# EAGLE design BEP30 (EAGLE 6.5.0)
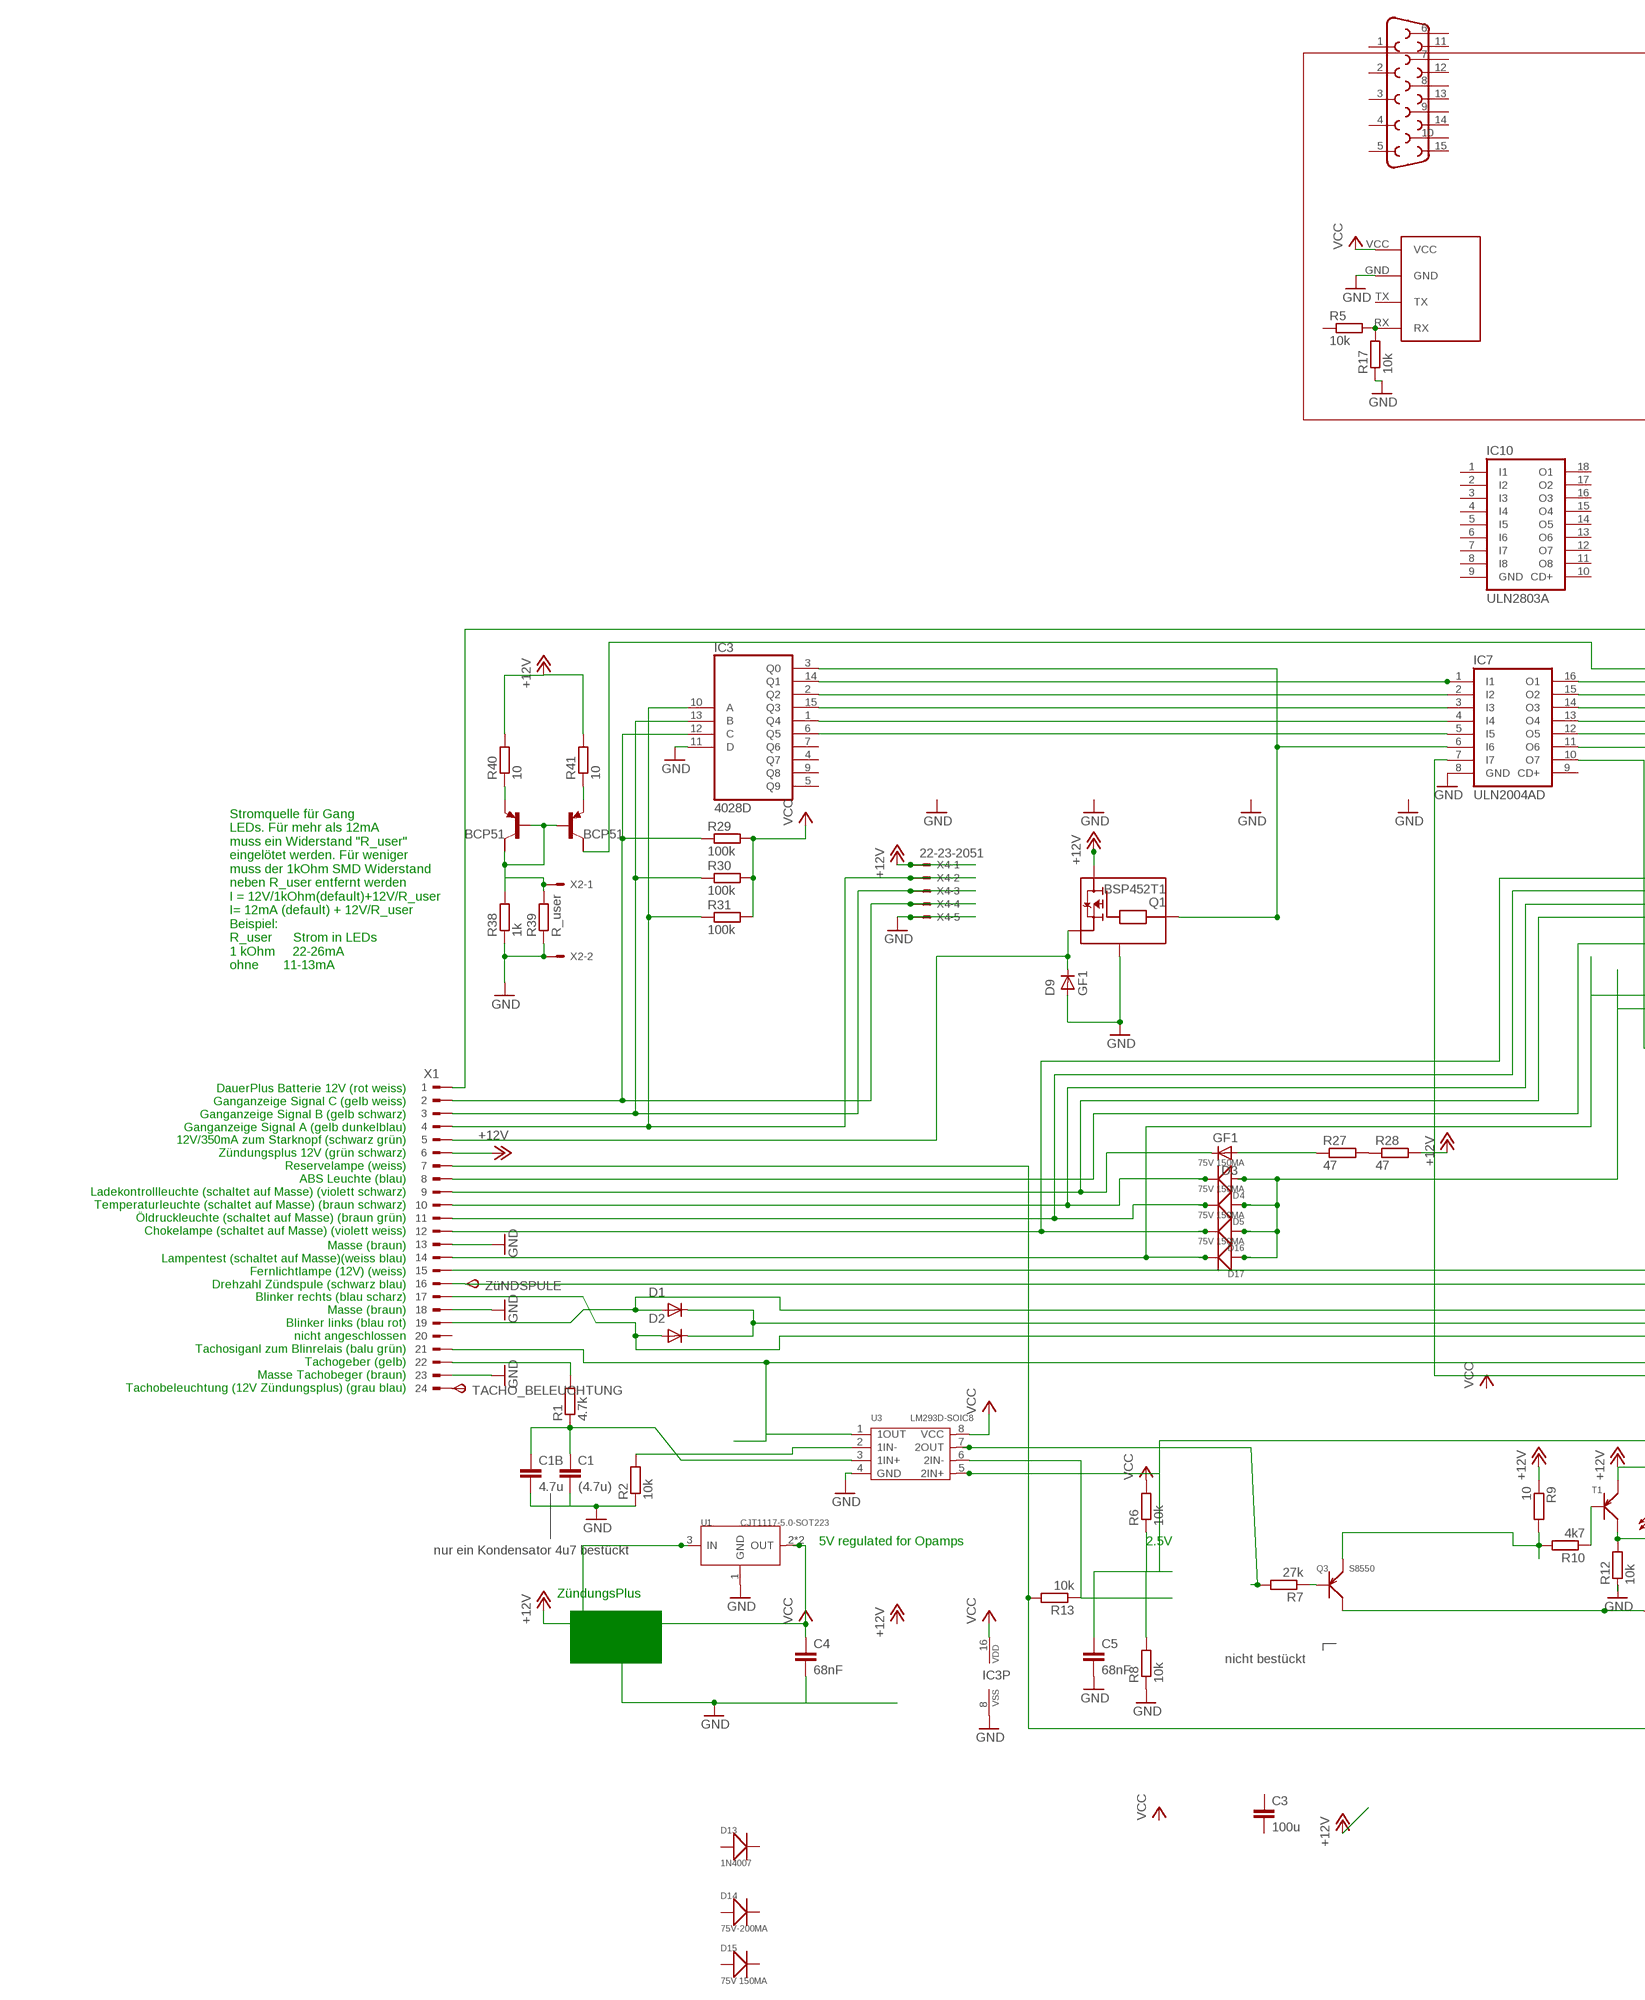
[diagram p0: schematic, sheet 1, part 1 of 2]
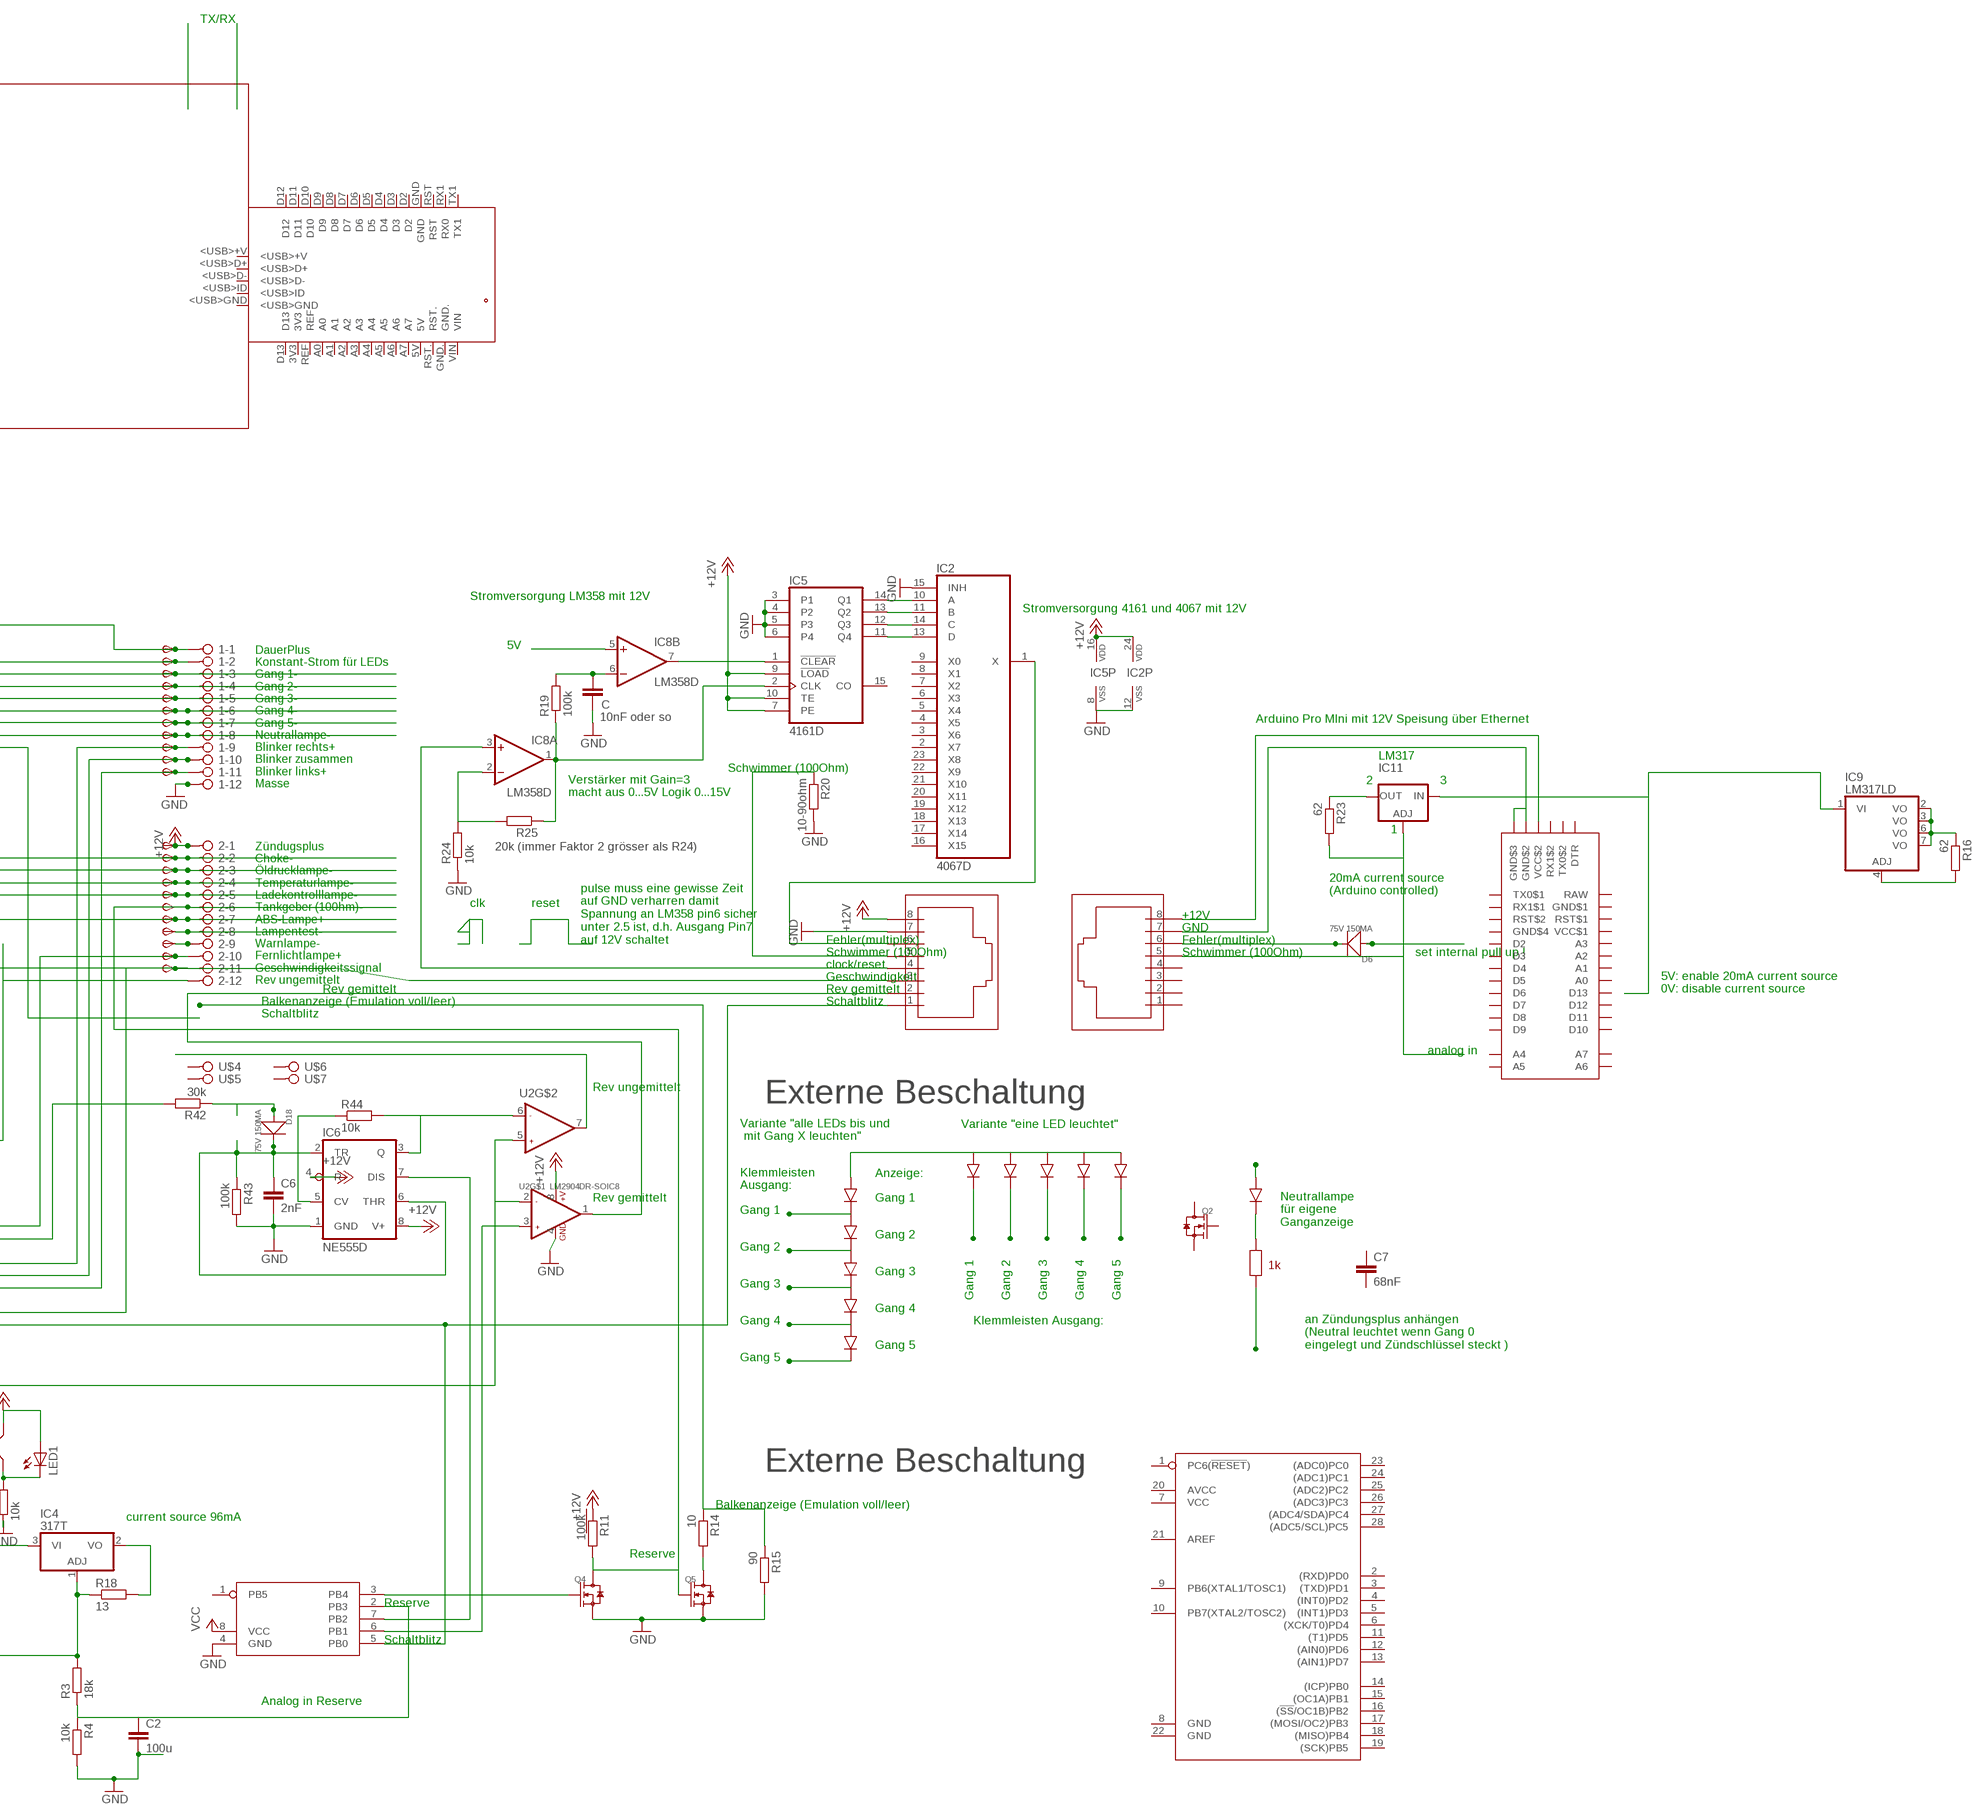
[diagram p1: schematic, sheet 1, part 2 of 2]

## Parts
1  2081-1132  [12-PIN]
2  2081-1132  [12-PIN]
C  10nF oder so  C-EUC0805K  [C0805K]
C1  (4.7u)  C-EUC1206  [C1206]
C1B  4.7u  C-EUC0805K  [C0805K]
C2  100u  C-EUC1206K  [C1206K]
C3  100u  C-EUC1206K  [C1206K]
C4  68nF  C-EUC1206K  [C1206K]
C5  68nF  C-EUC1206K  [C1206K]
C6  2nF  C-EUC1206K  [C1206K]
C7  68nF  C-EUC1206K  [C1206K]
D1  GF1  [SMA-DO214AC]
D2  GF1  [SMA-DO214AC]
D3  GF1  [SMA-DO214AC]
D4  75V 150MA  SMD-DIODE-SWITCHING-75V-150MA(D1206)  [LED-1206]
D5  75V 150MA  SMD-DIODE-SWITCHING-75V-150MA(D1206)  [LED-1206]
D6  75V 150MA  SMD-DIODE-SWITCHING-75V-150MA(D1206)  [LED-1206]
D9  GF1  [SMA-DO214AC]
D13  1N4007  DIODE-GEN-PURPOSE-1KV-1A(DO-214AC)  [DO-214AC]
D14  75V-200MA  SMD-DIODE-SWITCHING-75V-200MA(LL-34)  [LL-34]
D15  75V 150MA  SMD-DIODE-SWITCHING-75V-150MA(D1206)  [LED-1206]
D16  75V 150MA  SMD-DIODE-SWITCHING-75V-150MA(D1206)  [LED-1206]
D17  75V 150MA  SMD-DIODE-SWITCHING-75V-150MA(D1206)  [LED-1206]
D18  75V 150MA  SMD-DIODE-SWITCHING-75V-150MA(D1206)  [LED-1206]
IC1  ATMEGA328-DIP  [DIL28-SLIM]
IC2  4067D  [SO24W]
IC3  4028D  [SO16]
IC4  317T  [TO220H]
IC5  4161D  [SO16]
IC6  NE555D  [SO08]
IC7  ULN2004AD  [SO16]
IC8  LM358D  [SO08]
IC9  LM317LD  [SO08]
IC10  ULN2803A  ULN2803ASOP18  [SOP18]
IC11  LM317TS  [317TS]
J1  RJ45-TE  [RJ45-TE]
J2  RJ45-TE  [RJ45-TE]
J_BT_BOARD_1  BLUETOOTH_BOARD  [BT_BOARD_FOOTPRINT]
LED1  LED3MM  [LED3MM]
PCB1  ARDUINO_NANO  [ARDUINO_NANO]
Q1  BSP452T1  [SOT223]
Q2  SMD-MOSFET-N-CH-50V-200MA-BSS138W-7-F(SOT-23)  [SOT-23]
Q3  S8550  SMD-TRANSISTORS-PNP-25V-500MA-S8550(SOT-23)  [SOT-23]
Q4  SMD-MOSFET-N-CH-50V-200MA-BSS138W-7-F(SOT-23)  [SOT-23]
Q5  SMD-MOSFET-N-CH-50V-200MA-BSS138W-7-F(SOT-23)  [SOT-23]
R1  4.7k  R-EU_R0805  [R0805]
R2  10k  R-EU_R0805  [R0805]
R3  18k  R-EU_R0805  [R0805]
R4  10k  R-EU_R0805  [R0805]
R5  10k  R-EU_R0805  [R0805]
R6  10k  R-EU_R0805  [R0805]
R7  27k  R-EU_R0805  [R0805]
R8  10k  R-EU_R0805  [R0805]
R9  10  R-EU_R0805  [R0805]
R10  4k7  R-EU_R0805  [R0805]
R11  100k  R-EU_R0805  [R0805]
R12  10k  R-EU_R0805  [R0805]
R13  10k  R-EU_R0805  [R0805]
R14  10  R-EU_R0805  [R0805]
R15  90  R-EU_R0805  [R0805]
R16  62  R-EU_R0805  [R0805]
R17  10k  R-EU_R0805  [R0805]
R18  13  R-EU_R1206  [R1206]
R19  100k  R-EU_R0805  [R0805]
R20  10-90ohm  R-EU_R0805  [R0805]
R23  62  R-EU_R0805  [R0805]
R24  10k  R-EU_R0805  [R0805]
R25  20k (immer Faktor 2 grösser als R24)  R-EU_R0805  [R0805]
R27  47  R-EU_V235/17  [V235/17]
R28  47  R-EU_V235/17  [V235/17]
R29  100k  R-EU_R0805  [R0805]
R30  100k  R-EU_R0805  [R0805]
R31  100k  R-EU_R0805  [R0805]
R38  1k  R-EU_R0805  [R0805]
R39  R_user  R-EU_R0805  [R0805]
R40  10  R-EU_R0805  [R0805]
R41  10  R-EU_R0805  [R0805]
R42  30k  R-EU_R0805  [R0805]
R43  100k  R-EU_R0805  [R0805]
R44  10k  R-EU_R0805  [R0805]
T1  SMD-TRANSISTORS-PNP-25V-500MA-S8550(SOT-23)  [SOT-23]
T13  BCP53T1  [SOT223]
T14  BCP53T1  [SOT223]
TACHO_BELEUCHTUNG  TPSP1_1MM  [P1_1.0MM]
TP1  TPSB1,27  [B1,27]
TP2  TPSB1,27  [B1,27]
TP3  TPSB1,27  [B1,27]
TP4  TPSB1,27  [B1,27]
TP5  TPSB1,27  [B1,27]
TP6  TPSB1,27  [B1,27]
TP7  TPSB1,27  [B1,27]
TP8  TPSB1,27  [B1,27]
TP9  TPSB1,27  [B1,27]
TP10  TPSB1,27  [B1,27]
TP11  TPSB1,27  [B1,27]
TP12  TPSB1,27  [B1,27]
TP16  TPSB1,27  [B1,27]
TP17  TPSB1,27  [B1,27]
TP18  TPSB1,27  [B1,27]
TP19  TPSB1,27  [B1,27]
TP21  TPSB1,27  [B1,27]
TP22  TPSB1,27  [B1,27]
TP23  TPSB1,27  [B1,27]
TP24  TPSB1,27  [B1,27]
TP25  TPSB1,27  [B1,27]
TP26  TPSB1,27  [B1,27]
U1  CJT1117-5.0-SOT223  PMIC-CJT1117-5.0(SOT223)  [SOT-223]
U2  LM2904DR-SOIC8  AMPLIFIER-LM2904DR(SOIC8)  [SOIC8-1.27-5X4MM]
U3  LM293D-SOIC8  AMPLIFIER-LM293D(SOIC8)  [SOIC8-1.27-5X4MM]
U$1  TINY85P  [DIL08]
U$2  DB15  [DB15]
U$3  ARDUINO_PRO_MINI  [ARDUINO_PRO_MINI]
U$4  2081-1121  [1-PIN]
U$5  2081-1121  [1-PIN]
U$6  2081-1121  [1-PIN]
U$7  2081-1121  [1-PIN]
X1  CON_BMW  [24-PIN]
X2  22-23-2021  [22-23-2021]
X4  22-23-2051  [22-23-2051]
ZüNDSPULE  TPSP1_1MM  [P1_1.0MM]

## Nets
+12V: 2.1 IC2.24(VDD) IC5.7(PE) IC5.9(!LOAD) IC5.10(TE) IC5.16(VDD) IC6.4(R) IC6.8(V+) J1.8 LED1.A Q1.4(V+) R9.1 R11.1 R28.2 R40.2 R41.2 T1.2(E) TP12.TP(PP) U1.3(IN) U2.8(+V) X1.6 X4.1
GND: 1.12 C1.2 C1B.2 C2.2 C4.2 C5.2 C6.2 C.1 D9.A IC2.12(VSS) IC2.15(INH) IC3.8(VSS) IC3.11(D) IC5.3(P1) IC5.4(P2) IC5.5(P3) IC5.6(P4) IC5.8(VSS) IC6.1(GND) IC7.8(GND) J1.7 J_BT_BOARD_1.GND Q1.2(GND) Q4.2(S) Q5.2(S) R2.1 R4.2 R8.1 R12.1 R15.2 R17.1 R20.2 R24.1 R38.1 R39.1 R43.2 U1.1(GND) U2.4(GND) U3.4(GND) U$1.4(GND) X1.13 X1.18 X1.23 X2.2 X4.5
N$1: 2.12 D4.+ D5.+ D16.+ D17.+
N$2: IC3.10(A) R31.1 X1.4 X4.2
N$3: IC3.13(B) R30.1 X1.3 X4.3
N$4: 2.7 TP22.TP(PP) X1.8
N$6: IC3.3(Q0) IC7.6(I6) Q1.3(IN)
N$7: IC3.2(Q2) IC7.2(I2)
N$8: R27.2 R28.1
N$9: IC4.3(VI) Q3.3(C)
N$10: R13.1 U3.6(2IN-)
N$11: D9.K(C) Q1.1(OUT) X1.5
N$12: 2.2 D16.- TP16.TP(PP) X1.12
N$13: 2.3 D5.- TP17.TP(PP) X1.11
N$14: 2.4 D4.- TP18.TP(PP) X1.10
N$15: IC4.1(ADJ) R3.2 R13.2 R18.1 X1.7
N$16: Q4.1(G) U$1.3(PB4)
N$17: IC3.12(C) R29.1 X1.2 X4.4
N$18: 1.5 IC7.14(O3) TP5.TP(PP)
N$19: D6.- J2.6
N$20: 1.9 D1.A TP9.TP(PP) X1.19
N$21: 1.11 D2.A TP11.TP(PP) X1.17
N$22: 1.10 D1.K(C) D2.K(C) TP10.TP(PP)
N$23: R1.2 X1.22
N$24: C1.1 C1B.1 R1.1 U3.3(1IN+)
N$25: R2.2 U3.2(1IN-)
N$26: U3.1(1OUT) X1.21
N$27: 1.6 IC7.13(O4) TP6.TP(PP)
N$28: C2.1 R3.1 R4.1 U$1.2(PB3)
N$29: IC4.2(VO) R18.2
N$30: C5.1 R6.1 R8.2 U2.2(-IN1) U2.5(+IN2) U3.5(2IN+)
N$31: R10.1 T1.1(B)
N$32: R7.2 U3.7(2OUT)
N$34: Q3.1(B) R7.1
N$35: J_BT_BOARD_1.RX R5.2 R17.2
N$36: IC6.7(DIS) U$1.7(PB2)
N$37: IC3.14(Q1) IC7.1(I1)
N$38: U2.7(OUT2)
N$39: IC3.15(Q3) IC7.3(I3)
N$40: U2.3(+IN1) U$1.6(PB1)
N$41: R14.1 R15.1
N$42: R42.2 X1.16 ZüNDSPULE.TP(PP)
N$43: IC7.7(I7) J1.1 U$1.5(PB0)
N$44: Q3.2(E) R9.2 R10.2
N$45: LED1.K(C) R12.2 T1.3(C)
N$46: J1.2 U2.1(OUT1)
N$47: Q5.3(D) R14.2
N$48: IC7.10(O7)
N$50: IC3.1(Q4) IC7.4(I4)
N$51: 1.7 IC7.12(O5) TP7.TP(PP)
N$52: 1.8 IC7.11(O6) TP8.TP(PP)
N$53: 2.10 TP25.TP(PP) X1.15
N$54: D3.A R27.1
N$55: 2.5 D3.K(C) TP19.TP(PP) X1.9
N$56: J1.5 R20.1
N$57: IC2.10(A) IC5.14(Q1)
N$58: TACHO_BELEUCHTUNG.TP(PP) X1.24
N$59: 1.2 T14.2(C) TP2.TP(PP)
N$60: 2.6 Q4.3(D) Q5.1(G) R11.2 TP21.TP(PP)
N$61: IC9.2(VO) IC9.3(VO) IC9.6(VO) IC9.7(VO) R16.1
N$63: IC3.6(Q5) IC7.5(I5)
N$64: IC2.11(B) IC5.13(Q2)
N$65: IC2.14(C) IC5.12(Q3)
N$66: 1.4 IC7.15(O2) TP4.TP(PP)
N$67: 1.3 IC7.16(O1) TP3.TP(PP)
N$68: R38.2 R39.2 T13.1(B) T13.2(C) T14.1(B) X2.1
N$69: 1.1 TP1.TP(PP) X1.1
N$75: R40.1 T13.3(E)
N$83: R41.1 T14.3(E)
N$84: D18.+ R42.1
N$85: IC6.3(Q) R44.2 U2.6(-IN2)
N$86: IC6.5(CV) R44.1
N$87: IC2.13(D) IC5.11(Q4)
N$88: IC8.3(A:+IN) J1.4
N$89: C.2 IC8.6(B:-IN) R19.2
N$90: C6.1 D18.- IC6.2(TR) IC6.6(THR) R43.1
N$91: IC2.1(X) J1.6
N$92: 2.11 D17.- J1.3 TP26.TP(PP) X1.14
N$93: 2.9 TP24.TP(PP)
N$94: 2.8 TP23.TP(PP)
N$95: D6.+
N$96: IC11.1(ADJ) J2.5 R23.2
N$97: IC5.1(!CLEAR) IC8.7(B:OUT)
N$98: IC9.1(VI) IC11.3(IN)
N$99: J2.8 U$3.VCC$2
N$100: IC5.2(CLK) IC8.1(A:OUT) R19.1 R25.1
N$101: IC8.5(B:+IN)
N$102: J2.7 U$3.GND$2 U$3.GND$3
N$104: IC9.4(ADJ) R16.2
N$105: IC11.2(OUT) R23.1
N$106: IC8.2(A:-IN) R24.2 R25.2
VCC: C4.1 IC3.16(VDD) J_BT_BOARD_1.VCC R6.2 R29.2 R30.2 R31.2 U1.2(OUT) U1.TER(OUT) U3.8(VCC) U$1.8(VCC)
Unconnected: C3.1 C3.2 C7.1 C7.2 D13.1(+) D13.2(-) D14.A(+) D14.C(-) D15.+ D15.- IC1.1(PC6(!RESET!)) IC1.2((RXD)PD0) IC1.3((TXD)PD1) IC1.4((INT0)PD2) IC1.5((INT1)PD3) IC1.6((XCK/T0)PD4) IC1.9(PB6(XTAL1/TOSC1)) IC1.10(PB7(XTAL2/TOSC2)) IC1.11((T1)PD5) IC1.12((AIN0)PD6) IC1.13((AIN1)PD7) IC1.14((ICP)PB0) IC1.15((OC1A)PB1) IC1.16((!SS!/OC1B)PB2) IC1.17((MOSI/OC2)PB3) IC1.18((MISO)PB4) IC1.19((SCK)PB5) IC1.21(AREF) IC1.23((ADC0)PC0) IC1.24((ADC1)PC1) IC1.25((ADC2)PC2) IC1.26((ADC3)PC3) IC1.27((ADC4/SDA)PC4) IC1.28((ADC5/SCL)PC5) IC2.2(X7) IC2.3(X6) IC2.4(X5) IC2.5(X4) IC2.6(X3) IC2.7(X2) IC2.8(X1) IC2.9(X0) IC2.16(X15) IC2.17(X14) IC2.18(X13) IC2.19(X12) IC2.20(X11) IC2.21(X10) IC2.22(X9) IC2.23(X8) IC3.4(Q7) IC3.5(Q9) IC3.7(Q6) IC3.9(Q8) IC5.15(CO) IC7.9(CD+) IC10.1(I1) IC10.2(I2) IC10.3(I3) IC10.4(I4) IC10.5(I5) IC10.6(I6) IC10.7(I7) IC10.8(I8) IC10.10(CD+) IC10.11(O8) IC10.12(O7) IC10.13(O6) IC10.14(O5) IC10.15(O4) IC10.16(O3) IC10.17(O2) IC10.18(O1) J2.1 J2.2 J2.3 J2.4 J_BT_BOARD_1.TX PCB1.3V3 PCB1.5V PCB1.5V. PCB1.<USB>+V PCB1.<USB>D+ PCB1.<USB>D- PCB1.<USB>GND PCB1.<USB>ID PCB1.A0 PCB1.A1 PCB1.A2 PCB1.A3 PCB1.A4 PCB1.A5 PCB1.A6 PCB1.A7 PCB1.D2 PCB1.D3 PCB1.D4 PCB1.D5 PCB1.D6 PCB1.D7 PCB1.D8 PCB1.D9 PCB1.D10 PCB1.D11 PCB1.D12 PCB1.D13 PCB1.GND PCB1.GND. PCB1.GND_ PCB1.MISO PCB1.MOSI PCB1.REF PCB1.RESET.. PCB1.RST PCB1.RST. PCB1.RX1(RX0) PCB1.SCK PCB1.TX1 PCB1.VIN Q2.1(G) Q2.2(S) Q2.3(D) R5.1 T13.4(C/) T14.4(C/) U$1.1(PB5) U$2.1 U$2.2 U$2.3 U$2.4 U$2.5 U$2.6 U$2.7 U$2.8 U$2.9 U$2.10 U$2.11 U$2.12 U$2.13 U$2.14 U$2.15 U$3.A0 U$3.A1 U$3.A2 U$3.A3 U$3.A4 U$3.A5 U$3.A6 U$3.A7 U$3.D2 U$3.D3 U$3.D4 U$3.D5 U$3.D6 U$3.D7 U$3.D8 U$3.D9 U$3.D10 U$3.D11 U$3.D12 U$3.D13 U$3.DTR U$3.RST$1 U$3.RST$2 U$3.RX1$1 U$3.RX1$2 U$3.TX0$1 U$3.TX0$2 U$4.1(KL) U$5.1(KL) U$6.1(KL) U$7.1(KL) X1.20

## Notes on the sheet
- TX/RX
- Stromversorgung LM358 mit 12V
- Stromversorgung 4161 und 4067 mit 12V
- 5V
- DauerPlus
  Konstant-Strom für LEDs
  Gang 1-
  Gang 2-
  Gang 3-
  Gang 4-
  Gang 5-
  Neutrallampe-
  Blinker rechts+
  Blinker zusammen
  Blinker links+
  Masse
- Arduino Pro MIni mit 12V Speisung über Ethernet
- LM317
- Schwimmer (100Ohm)
- 2 | 3
- Verstärker mit Gain=3
  macht aus 0...5V Logik 0...15V
- 1
- 20mA current source 
  (Arduino controlled)
- clk | reset
- Zündugsplus
  Choke-
  Öldrucklampe-
  Temperaturlampe-
  Ladekontrolllampe-
  Tankgeber (100hm)-
  ABS-Lampe+
  Lampentest-
  Warnlampe-
  Fernlichtlampe+
  Geschwindigkeitssignal
  Rev ungemittelt
- +12V
- GND
- Stromquelle für Gang
  LEDs. Für mehr als 12mA
  muss ein Widerstand "R_user"
  eingelötet werden. Für weniger
  muss der 1kOhm SMD Widerstand
  neben R_user entfernt werden
  I = 12V/1kOhm(default)+12V/R_user
  I= 12mA (default) + 12V/R_user
  Beispiel:
  R_user      Strom in LEDs
  1 kOhm     22-26mA
  ohne       11-13mA
- pulse muss eine gewisse Zeit 
  auf GND verharren damit
  Spannung an LM358 pin6 sicher
  unter 2.5 ist, d.h. Ausgang Pin7
  auf 12V schaltet
- Fehler(multiplex) | Fehler(multiplex)
- Schwimmer (100Ohm) | Schwimmer (100Ohm) | set internal pull up !
- clock/reset
- Geschwindigkeit
- Rev gemittelt | Rev gemittelt
- 5V: enable 20mA current source
  0V: disable current source
- Balkenanzeige (Emulation voll/leer) | Schaltblitz
- Schaltblitz
- analog in
- Rev ungemittelt
- Externe Beschaltung
- DauerPlus Batterie 12V (rot weiss)
  Ganganzeige Signal C (gelb weiss)
  Ganganzeige Signal B (gelb schwarz)
  Ganganzeige Signal A (gelb dunkelblau)
  12V/350mA zum Starknopf (schwarz grün)
  Zündungsplus 12V (grün schwarz)
  Reservelampe (weiss)
  ABS Leuchte (blau)
  Ladekontrollleuchte (schaltet auf Masse) (violett schwarz)
  Temperaturleuchte (schaltet auf Masse) (braun schwarz)
  Öldruckleuchte (schaltet auf Masse) (braun grün)
  Chokelampe (schaltet auf Masse) (violett weiss)
- Variante "eine LED leuchtet"
- Variante "alle LEDs bis und
   mit Gang X leuchten"
- Anzeige:
- Klemmleisten
  Ausgang:
- Rev gemittelt | Gang 1
- Gang 1
- Neutrallampe
  für eigene
  Ganganzeige
- Gang 2
- Gang 2
- Masse (braun)
  Lampentest (schaltet auf Masse)(weiss blau)
  Fernlichtlampe (12V) (weiss)
  Drehzahl Zündspule (schwarz blau)
  Blinker rechts (blau scharz)
  Masse (braun)
  Blinker links (blau rot)
  nicht angeschlossen
  Tachosiganl zum Blinrelais (balu grün)
  Tachogeber (gelb)
  Masse Tachobeger (braun)
  Tachobeleuchtung (12V Zündungsplus) (grau blau)
- 1k
- Gang 3
- Gang 3
- Gang 1 | Gang 2 | Gang 3 | Gang 4 | Gang 5
- Gang 4
- Gang 4 | Klemmleisten Ausgang:
- Gang 5
- an Zündungsplus anhängen
  (Neutral leuchtet wenn Gang 0
  eingelegt und Zündschlüssel steckt )
- Gang 5
- Externe Beschaltung
- nur ein Kondensator 4u7 bestückt | 5V regulated for Opamps | 2.5V
- Balkenanzeige (Emulation voll/leer)
- current source 96mA
- ZündungsPlus
- Reserve
- nicht bestückt
- Reserve
- Schaltblitz
- Analog in Reserve

## Power pins joined to a net without a drawn wire
AVCC: IC1.20(AVCC)
GND: IC1.8(GND) IC1.22(GND) IC10.9(GND)
GND$1: U$3.GDN$1(GND$1)
GND$4: U$3.GND$4
RAW: U$3.RAW
V+: IC8.8(P:V+)
V-: IC8.4(P:V-)
VCC: IC1.7(VCC)
VCC$1: U$3.VCC$1

## Library data of the parts
1 2 = con WAGO BMW:2081-1132: WAGO SREW CLAMP
C C1 C1B C2-C7 = rcl:C-EU: CAPACITOR, European symbol
D1-D3 D9 = diode:GF1: DIODE
D4-D6 D15-D18 = Seeed-Diode-2016:SMD-DIODE-SWITCHING-75V-150MA(D1206): 304040005; MPN: CD1206-S01575
D13 = Seeed-Diode-2016:DIODE-GEN-PURPOSE-1KV-1A(DO-214AC): 304010013; MPN: 1N4007
D14 = Seeed-Diode-2016:SMD-DIODE-SWITCHING-75V-200MA(LL-34): 304040011; MPN: LL4148ST
IC1 = ATMEGA_-DIP:ATMEGA*-DIP
IC2 = 40xx:4067: 16-channel ANALOG MULTIPLEXER
IC3 = 40xx:4028: BCD to decimal DECODER
IC4 = linear_BMW:*317: Positive VOLTAGE REGULATOR
IC5 = 40xx:4161: Synchronous presettable 4-bit binary COUNTER
IC6 = linear:*555: TIMER
IC7 = uln-udn:ULN2004A: DRIVER ARRAY
IC8 = linear:LM358: OP AMP also LM158; LM258; LM2904 Source: http://cache.national.com/ds/LM/LM158.pdf
IC9 = linear:LM317LD: LOW CURRENT 1.2 TO 37V ADJUSTABLE VOLTAGE REGULATOR Source: http://pdf.alldatasheet.com
IC10 = uln-udn:ULN2803A: DRIVER ARRAY
IC11 = v-reg:LM317TS: VOLTAGE REGULATOR
J1 J2 = RJ45:RJ45
J_BT_BOARD_1 = BLUETOOTH_BOARD:BLUETOOTH_BOARD
LED1 = led:LED: LED OSRAM: - CHIPLED LG R971, LG N971, LY N971, LG Q971, LY Q971, LO R971, LY R971 LH N974, LH R974 LS Q976, LO Q976, LY Q976 LO Q996 - Hyper CHIPLED LW Q18S LB Q993, LB Q99A, LB R99A - SideLED LS A670, LO A670, LY A670, LG A670, LP A670 LB A673, LV A673, LT A673, LW A673 LH A674 LY A675 LS A676, LA A676, LO A676, LY A676, LW A676 LS A679, LY A679, LG A679 - Hyper Micro SIDELED® LS Y876, LA Y876, LO Y876, LY Y876 LT Y87S - SmartLED LW L88C, LW L88S LB L89C, LB L89S, LG L890 LS L89K, LO L89K, LY L89K LS L896, LA L896, LO L896, LY L896 - TOPLED LS T670, LO T670, LY T670, LG T670, LP T670 LSG T670, LSP T670, LSY T670, LOP T670, LYG T670 LG T671, LOG T671, LSG T671 LB T673, LV T673, LT T673, LW T673 LH T674 LS T676, LA T676, LO T676, LY T676, LB T676, LH T676, LSB T676, LW T676 LB T67C, LV T67C, LT T67C, LS T67K, LO T67K, LY T67K, LW E67C LS E67B, LA E67B, LO E67B, LY E67B, LB E67C, LV E67C, LT E67C LW T67C LS T679, LY T679, LG T679 LS T770, LO T770, LY T770, LG T770, LP T770 LB T773, LV T773, LT T773, LW T773 LH T774 LS E675, LA E675, LY E675, LS T675 LS T776, LA T776, LO T776, LY T776, LB T776 LHGB T686 LT T68C, LB T68C - Hyper Mini TOPLED® LB M676 - Mini TOPLED Santana® LG M470 LS M47K, LO M47K, LY M47K Source: http://www.osram.convergy.de LUXEON: - LUMILED® LXK2-PW12-R00, LXK2-PW12-S00, LXK2-PW14-U00, LXK2-PW14-V00 LXK2-PM12-R00, LXK2-PM12-S00, LXK2-PM14-U00 LXK2-PE12-Q00, LXK2-PE12-R00, LXK2-PE12-S00, LXK2-PE14-T00, LXK2-PE14-U00 LXK2-PB12-K00, LXK2-PB12-L00, LXK2-PB12-M00, LXK2-PB14-N00, LXK2-PB14-P00, LXK2-PB14-Q00 LXK2-PR12-L00, LXK2-PR12-M00, LXK2-PR14-Q00, LXK2-PR14-R00 LXK2-PD12-Q00, LXK2-PD12-R00, LXK2-PD12-S00 LXK2-PH12-R00, LXK2-PH12-S00 LXK2-PL12-P00, LXK2-PL12-Q00, LXK2-PL12-R00 Source: www.luxeon.com KINGBRIGHT: KA-3528ASYC Source: www.kingbright.com
PCB1 = ARDUINO_NANO:ARDUINO_NANO
Q1 = BSP452:BSP452
Q2 Q4 Q5 = Seeed-Transistor-2016:SMD-MOSFET-N-CH-50V-200MA-BSS138W-7-F(SOT-23): 305030000; MPN: BSS138W-7-F; VALUE: BSS138W-7-F
Q3 = Seeed-Transistor-2016:SMD-TRANSISTORS-PNP-25V-500MA-S8550(SOT-23): 305020006; MPN: S8550
R1-R20 R23-R25 R27-R31 R38-R44 = rcl:R-EU_: RESISTOR, European symbol
T1 = Seeed-Transistor-2016:SMD-TRANSISTORS-PNP-25V-500MA-S8550(SOT-23): 305020006; MPN: S8550; VALUE: S8550
T13 T14 = BCP53_:BCP53*; T: BCP51
TACHO_BELEUCHTUNG TP1-TP12 TP16-TP19 TP21-TP26 ZüNDSPULE = testpin_BMW:TPS: TEST PIN
U1 = Seeed-IC-2016:PMIC-CJT1117-5.0(SOT223): 310030096; MPN: CJT1117-5.0
U2 = Seeed-IC-2016:AMPLIFIER-LM2904DR(SOIC8): 310020015; MPN: LM2904DR
U3 = Seeed-IC-2016:AMPLIFIER-LM293D(SOIC8): 310020016; MPN: LM293D
U$1 = TINY85:TINY85
U$2 = DB15:DB15
U$3 = ARDUINO_PRO_MINI:ARDUINO_PRO_MINI
U$4-U$7 = con WAGO BMW:2081-1121
X1 = con_BMW:CON_BMW: BMW CONNECTOR
X2 = con-molex:22-23-2021: .100" (2.54mm) Center Header - 2 Pin; MF: MOLEX; MPN: 22-23-2021; OC_FARNELL: 1462926; OC_NEWARK: 25C3832
X4 = con-molex:22-23-2051: .100" (2.54mm) Center Header - 5 Pin; MF: MOLEX; MPN: 22-23-2051; OC_FARNELL: 1462952; OC_NEWARK: 38C9178

## Board
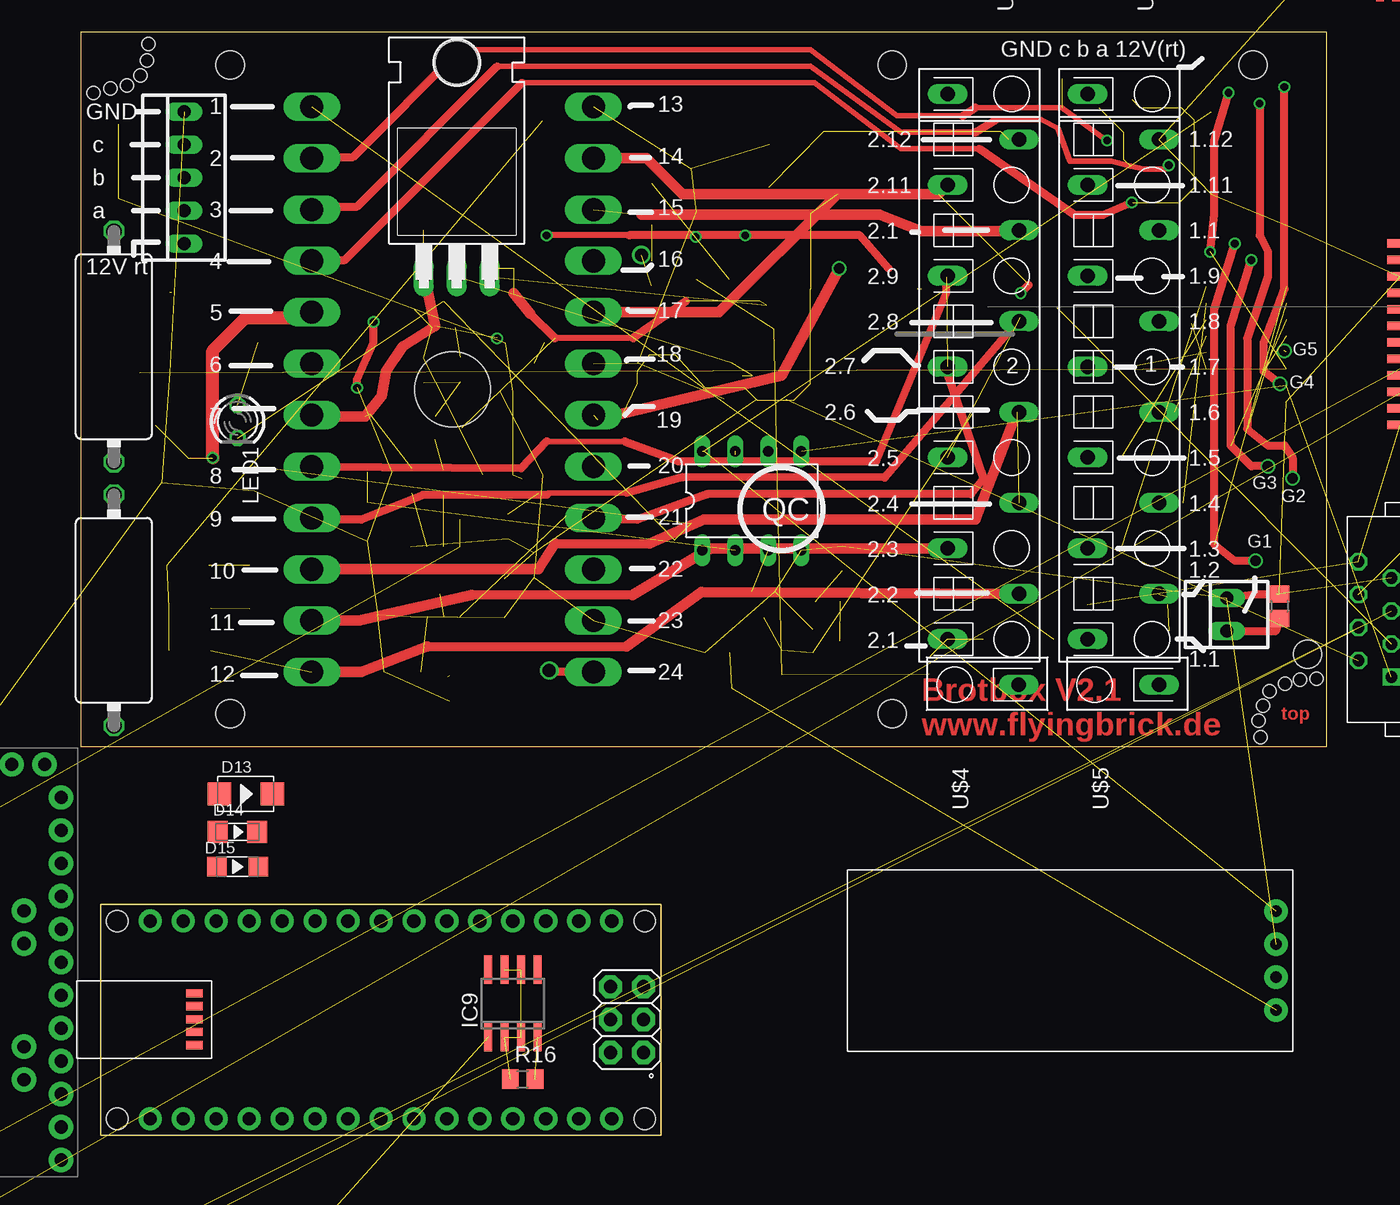
[diagram p2: board, top side]
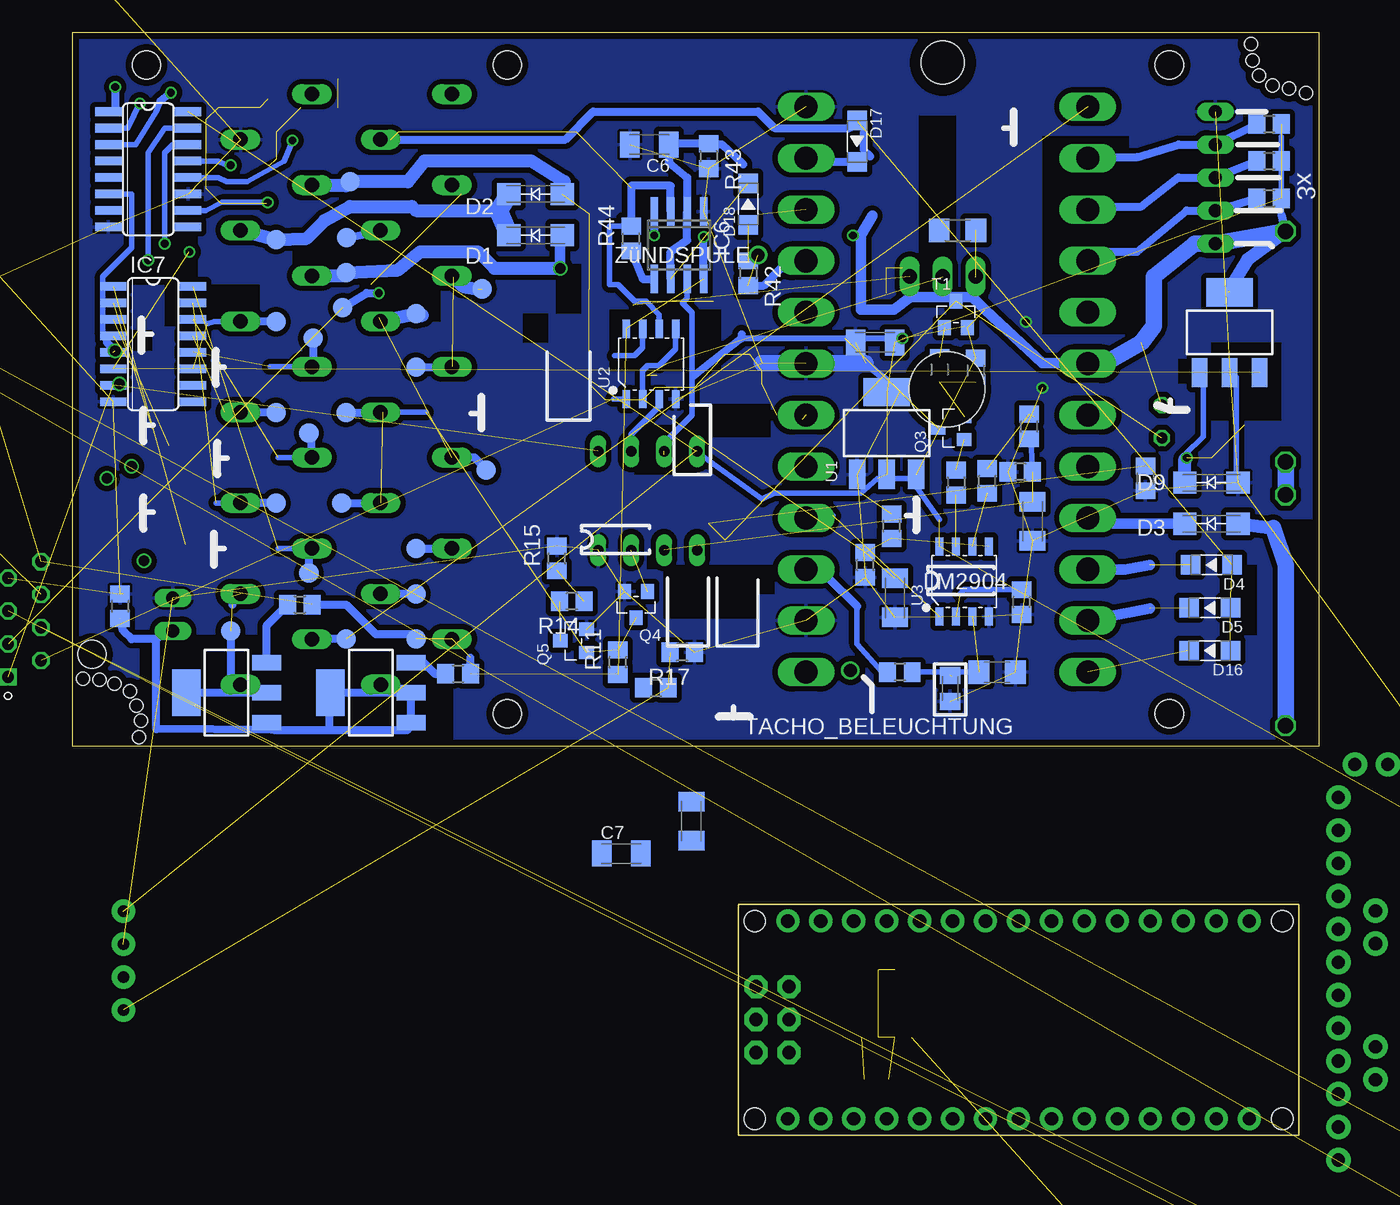
[diagram p3: board, bottom side, seen from below]

Size 96 x 55 mm. Coordinates in mm from the lower left corner, seen from the top.
Outline: 0,0 96,0 96,55 0,55 0,0
Copper layers (1*16): Top 0.035mm / dielectric 1.5mm / Bottom 0.035mm
Design rules "multi-cb_035um-cu *": minimum track width 6mil, minimum drill 12mil, track to track 16mil, track to pad 20mil, pad to pad 16mil, via to via 16mil, smd to smd 16mil, copper to edge 20mil, drill to drill 8mil, minimum pad ring 8mil, minimum via ring 6mil, stop-mask expansion 3mil, vias tented up to drill 0mil, thermal gap 8mil
Holes 5.8 mm at 28.64,27.5
Holes 2.18 mm at 11.5,52.5 62.5,52.5 11.5,2.5 62.5,2.5 90.3,52.5 94.5,7.1
Holes 1.02 mm at 0.95,50.36 2.29,50.67 3.56,50.93 4.57,51.69 5.21,54.1 95.19,5.21 93.92,5.14 92.77,4.83 91.06,3.11 90.74,1.97 90.87,0.7 91.57,4.25 5.08,52.83
bRestrict: area 27.9,35.9 to 30.8,48.6; area 14.6,31.8 to 21.3,47; area 47.9,21 to 52.7,23.8; area 43.2,9.8 to 50.5,14; area 41.9,11.7 to 43.8,14; area 49.8,13.7 to 51.8,14.9; area 42.2,23.8 to 47.6,26.4; area 59.4,31.1 to 61.3,33.3; area 46,28.9 to 54.6,33.7; area 66.7,0.6 to 90.8,8.6; area 2.9,25.1 to 8.3,31.1; area 56.8,33.3 to 58.7,37.1; area 67.6,32.7 to 73.7,40; area 73.7,35.6 to 79.1,39.7; area 86.4,35.6 to 91.8,39.7; area 89.9,30.5 to 91.8,32.1; area 81.6,32.4 to 88.9,35.6; area 0.6,15.9 to 2.5,17.5; area 4.8,8.6 to 7.6,14; area 8.6,27.9 to 10.8,29.8; area 25.1,4.4 to 25.7,7; area 49,23.7 to 52.1,24.8

### Footprints (pad centres in the part's own frame; a part is rotated, then mirrored left to right if it is on the bottom)
12-PIN = drill 1.118 long: 1 19.25,-2.45; 2 15.75,3.05; 3 12.25,-2.45; 4 8.75,3.05; 5 5.25,-2.45; 6 1.75,3.05; 7 -1.75,-2.45; 8 -5.25,3.05; 9 -8.75,-2.45; 10 -12.25,3.05; 11 -15.75,-2.45; 12 -19.25,3.05
C0805K = smd 1.3 x 1.6: 1 -1,0; 2 1,0
C1206 = smd 1.6 x 1.8: 1 -1.4,0; 2 1.4,0
C1206K = smd 1.5 x 2: 1 -1.5,0; 2 1.5,0
SMA-DO214AC = smd 1.8 x 1.7: A -2.05,0; K 2.05,0
LED-1206 = smd 1.5 x 1.5: + -1.6,0; - 1.6,0
DO-214AC = smd 1.8 x 1.77: 1 -2.042,0; 2 2.042,0
LL-34 = smd 1.524 x 1.676: A -1.524,0; C 1.524,0
DIL28-SLIM = drill 0.813 long: 1 -16.51,-3.81; 2 -13.97,-3.81; 3 -11.43,-3.81; 4 -8.89,-3.81; 5 -6.35,-3.81; 6 -3.81,-3.81; 7 -1.27,-3.81; 8 1.27,-3.81; 9 3.81,-3.81; 10 6.35,-3.81; 11 8.89,-3.81; 12 11.43,-3.81; 13 13.97,-3.81; 14 16.51,-3.81; 15 16.51,3.81; 16 13.97,3.81; 17 11.43,3.81; 18 8.89,3.81; 19 6.35,3.81; 20 3.81,3.81; 21 1.27,3.81; 22 -1.27,3.81; 23 -3.81,3.81; 24 -6.35,3.81; 25 -8.89,3.81; 26 -11.43,3.81; 27 -13.97,3.81; 28 -16.51,3.81
SO24W = smd 0.66 x 2.032: 1 -6.985,-5.029; 2 -5.715,-5.029; 3 -4.445,-5.029; 4 -3.175,-5.029; 5 -1.905,-5.029; 6 -0.635,-5.029; 7 0.635,-5.029; 8 1.905,-5.029; 9 3.175,-5.029; 10 4.445,-5.029; 11 5.715,-5.029; 12 6.985,-5.029; 13 6.985,5.029; 14 5.715,5.029; 15 4.445,5.029; 16 3.175,5.029; 17 1.905,5.029; 18 0.635,5.029; 19 -0.635,5.029; 20 -1.905,5.029; 21 -3.175,5.029; 22 -4.445,5.029; 23 -5.715,5.029; 24 -6.985,5.029
SO16 = smd 0.66 x 2.032: 1 -4.445,-3.073; 2 -3.175,-3.073; 3 -1.905,-3.073; 4 -0.635,-3.073; 5 0.635,-3.073; 6 1.905,-3.073; 7 3.175,-3.073; 8 4.445,-3.073; 9 4.445,3.073; 10 3.175,3.073; 11 1.905,3.073; 12 0.635,3.073; 13 -0.635,3.073; 14 -1.905,3.073; 15 -3.175,3.073; 16 -4.445,3.073
TO220H = drill 1.118 long: 1 -2.54,-10.16; 2 0,-10.16; 3 2.54,-10.16 | hole 3.302: 0,6.326
SO08 = smd 0.6 x 2.2: 1 -1.905,-2.6; 2 -0.635,-2.6; 3 0.635,-2.6; 4 1.905,-2.6; 5 1.905,2.6; 6 0.635,2.6; 7 -0.635,2.6; 8 -1.905,2.6
SOP18 = smd 0.6 x 2.2: 1 -5.08,-3.6; 2 -3.81,-3.6; 3 -2.54,-3.6; 4 -1.27,-3.6; 5 0,-3.6; 6 1.27,-3.6; 7 2.54,-3.6; 8 3.81,-3.6; 9 5.08,-3.6; 10 5.08,3.6; 11 3.81,3.6; 12 2.54,3.6; 13 1.27,3.6; 14 0,3.6; 15 -1.27,3.6; 16 -2.54,3.6; 17 -3.81,3.6; 18 -5.08,3.6
317TS = drill 1.016 long: 1 -2.54,-2.54; 2 0,-2.54; 3 2.54,-2.54
RJ45-TE = drill 0.914 square: 1 -4.445,6.35 | drill 0.914 octagon: 2 -3.175,8.89; 3 -1.905,6.35; 4 -0.635,8.89; 5 0.635,6.35; 6 1.905,8.89; 7 3.175,6.35; 8 4.445,8.89 | hole 3.251: 5.715,0; -5.715,0
BT_BOARD_FOOTPRINT = drill 0.9 pad 1.778: GND -16.51,-1.27; RX -16.51,3.81; TX -16.51,1.27; VCC -16.51,-3.81
LED3MM = drill 0.813 octagon: A -1.27,0; K 1.27,0
ARDUINO_NANO = drill 1.016 pad 1.778: 3V3 6.35,1.27; 5V 31.75,1.27; A0 11.43,1.27; A1 13.97,1.27; A2 16.51,1.27; A3 19.05,1.27; A4 21.59,1.27; A5 24.13,1.27; A6 26.67,1.27; A7 29.21,1.27; D2 29.21,16.51; D3 26.67,16.51; D4 24.13,16.51; D5 21.59,16.51; D6 19.05,16.51; D7 16.51,16.51; D8 13.97,16.51; D9 11.43,16.51; D10 8.89,16.51; D11 6.35,16.51; D12 3.81,16.51; D13 3.81,1.27; GND 31.75,16.51; GND. 36.83,1.27; REF 8.89,1.27; RST 34.29,16.51; RST. 34.29,1.27; RX1 36.83,16.51; TX1 39.37,16.51; VIN 39.37,1.27 | drill 1.016 pad 1.778 octagon: 5V. 39.268,6.375; GND_ 39.268,11.455; MISO 41.808,6.375; MOSI 39.268,8.915; RESET.. 41.808,11.455; SCK 41.808,8.915 | smd 1.27 x 0.635: <USB>+V 7.214,10.947; <USB>D+ 7.214,9.957; <USB>D- 7.214,8.941; <USB>GND 7.214,6.96; <USB>ID 7.214,7.976 | hole 1.651: 1.27,1.27; 1.27,16.51; 41.91,16.51; 41.91,1.27
SOT223 = smd 1.219 x 2.235: 1 -2.311,-3.099; 2 0,-3.099; 3 2.311,-3.099 | smd 3.6 x 2.2: 4 0,3.099
SOT-23 = smd 1.016 x 1.143: 1 -0.889,-1.016; 2 0.889,-1.016; 3 0,1.016
R0805 = smd 1.3 x 1.5: 1 -0.95,0; 2 0.95,0
R1206 = smd 1.6 x 1.803: 1 -1.422,0; 2 1.422,0
V235/17 = drill 1.194 octagon: 1 -8.89,0; 2 8.89,0
P1_1.0MM = drill 1.016: TP 0,0
B1,27 = smd 1.5 x 1.5: TP 0,0
SOT-223 = smd 1.27 x 2.286: 1 -2.286,-3.175; 2 0,-3.175; 3 2.286,-3.175 | smd 3.556 x 2.159: TER 0,3.175
SOIC8-1.27-5X4MM = smd 0.6 x 1.4: 1 -1.905,-2.7; 2 -0.635,-2.7; 3 0.635,-2.7; 4 1.905,-2.7; 5 1.905,2.7; 6 0.635,2.7; 7 -0.635,2.7; 8 -1.905,2.7
DIL08 = drill 0.813 long: 1 -3.81,-3.81; 2 -1.27,-3.81; 3 1.27,-3.81; 4 3.81,-3.81; 5 3.81,3.81; 6 1.27,3.81; 7 -1.27,3.81; 8 -3.81,3.81
DB15 = drill 1.016 pad 1.88: 1 -4.32,-7.62; 2 -2.03,-7.62; 3 0.26,-7.62; 4 2.55,-7.62; 5 4.84,-7.62; 6 -5.46,-5.08; 7 -3.17,-5.08; 8 -0.88,-5.08; 9 1.41,-5.08; 10 3.7,-5.08; 11 -4.32,-2.54; 12 -2.03,-2.54; 13 0.26,-2.54; 14 2.55,-2.54; 15 4.84,-2.54 | drill 3.302 pad 5.08: G1 -12.5,-5.08; G2 12.5,-5.08
ARDUINO_PRO_MINI = drill 1.016 pad 1.88: A0 7.62,-5.08; A1 7.62,-2.54; A2 7.62,0; A3 7.62,2.54; A4 4.763,1.429; A5 4.763,3.969; A6 4.763,-9.049; A7 4.763,-6.509; D2 -7.62,2.54; D3 -7.62,0; D4 -7.62,-2.54; D5 -7.62,-5.08; D6 -7.62,-7.62; D7 -7.62,-10.16; D8 -7.62,-12.7; D9 -7.62,-15.24; D10 7.62,-15.24; D11 7.62,-12.7; D12 7.62,-10.16; D13 7.62,-7.62; DTR 6.35,15.24; GDN$1 7.62,10.16; GND$2 -3.81,15.24; GND$3 -6.35,15.24; GND$4 -7.62,5.08; RAW 7.62,12.7; RST$1 7.62,7.62; RST$2 -7.62,7.62; RX1$1 -7.62,10.16; RX1$2 1.27,15.24; TX0$1 -7.62,12.7; TX0$2 3.81,15.24; VCC$1 7.62,5.08; VCC$2 -1.27,15.24
1-PIN = drill 1.118 long: 1 1.75,-2.45
24-PIN = drill 1.778 long: 1 -21.78,-10.85; 2 -17.82,-10.85; 3 -13.86,-10.85; 4 -9.9,-10.85; 5 -5.94,-10.85; 6 -1.98,-10.85; 7 1.98,-10.85; 8 5.94,-10.85; 9 9.9,-10.85; 10 13.86,-10.85; 11 17.82,-10.85; 12 21.78,-10.85; 13 -21.78,10.85; 14 -17.82,10.85; 15 -13.86,10.85; 16 -9.9,10.85; 17 -5.94,10.85; 18 -1.98,10.85; 19 1.98,10.85; 20 5.94,10.85; 21 9.9,10.85; 22 13.86,10.85; 23 17.82,10.85; 24 21.78,10.85
22-23-2021 = drill 1 long: 1 -1.27,0; 2 1.27,0
22-23-2051 = drill 1 long: 1 -5.08,0; 2 -2.54,0; 3 0,0; 4 2.54,0; 5 5.08,0

### Placement (x,y rotation side)
1  80.01,27.5 270 top
2  69.22,27.5 270 top
C  -28,-49 0 top  (outside the outline)
C1  24.77,5.71 0 bottom
C1B  28.38,4.45 270 bottom
C2  22.03,17.34 270 bottom
C3  48.32,-5.78 270 bottom  (outside the outline)
C4  34.16,31.11 180 bottom
C5  32.64,11.43 270 bottom
C6  51.56,46.35 180 bottom
C7  53.72,-8.26 0 bottom  (outside the outline)
D1  60.33,39.37 180 bottom
D2  60.33,42.55 180 bottom
D3  8.26,17.14 180 bottom
D4  8.26,13.97 180 bottom
D5  8.38,10.67 180 bottom
D6  -33.66,-53.98 0 top  (outside the outline)
D9  8.26,20.32 180 bottom
D13  12.7,-3.68 0 top  (outside the outline)
D14  12.06,-6.6 0 top  (outside the outline)
D15  12.06,-9.27 0 top  (outside the outline)
D16  8.38,7.37 180 bottom
D17  35.56,46.61 270 bottom
D18  43.94,41.78 90 bottom
IC1  -25.02,-18.67 270 top  (outside the outline)
IC2  106.68,31.75 90 top  (outside the outline)
IC3  90.17,44.45 270 bottom
IC4  28.96,46.35 0 top
IC5  119.25,43.56 90 top  (outside the outline)
IC6  49.28,38.61 180 bottom
IC7  89.79,30.99 270 bottom
IC8  -41.27,-57.78 0 top  (outside the outline)
IC9  33.27,-19.81 0 top  (outside the outline)
IC10  105.16,62.1 180 top  (outside the outline)
IC11  -40.01,-96.52 0 top  (outside the outline)
J1  107.31,9.78 90 top
J2  -32.38,-76.83 0 top  (outside the outline)
J_BT_BOARD_1  75.56,-16.51 180 top  (outside the outline)
LED1  12.06,25.02 270 top
PCB1  1.52,-29.97 0 top  (outside the outline)
Q1  6.86,31.88 0 bottom
Q2  -34.29,-47.62 0 top  (outside the outline)
Q3  28.32,24.51 90 bottom
Q4  52.58,10.92 180 bottom
Q5  57.4,8.13 90 bottom
R1  32.26,5.71 180 bottom
R2  22.86,11.11 90 bottom
R3  22.29,24.64 90 bottom
R4  22.99,21.15 180 bottom
R5  51.05,4.51 0 bottom
R6  32.89,16.95 90 bottom
R7  27.94,20.32 270 bottom
R8  34.92,13.97 90 bottom
R9  26.42,28.96 270 bottom
R10  29.21,29.02 270 bottom
R11  53.98,6.48 90 bottom
R12  13.34,20.64 90 bottom
R13  25.53,20.45 90 bottom
R14  57.53,11.18 180 bottom
R15  58.67,14.48 90 bottom
R16  34.04,-25.65 0 top  (outside the outline)
R17  49.02,7.24 180 bottom
R18  27.81,39.75 180 bottom
R19  -28,-42 0 top  (outside the outline)
R20  -34.29,-59.05 0 top  (outside the outline)
R23  -43.18,-106.05 0 top  (outside the outline)
R24  -43.18,-112.39 0 top  (outside the outline)
R25  -43.18,-118.75 0 top  (outside the outline)
R27  2.54,10.48 90 top
R28  2.54,30.8 90 top
R29  3.81,47.94 0 bottom
R30  3.81,45.09 0 bottom
R31  3.81,42.23 0 bottom
R38  92.33,10.79 270 bottom
R39  92.33,10.79 270 top
R40  66.29,5.59 0 bottom
R41  78.49,10.92 0 bottom
R42  43.94,36.45 270 bottom
R43  46.99,45.47 270 bottom
R44  52.96,39.12 90 bottom
T1  27.94,33.27 0 bottom
T13  73.03,4.13 90 bottom
T14  84.14,4.13 90 bottom
TACHO_BELEUCHTUNG  36.07,5.84 0 bottom
TP1  74.93,8.26 0 bottom
TP2  83.82,8.89 0 bottom
TP3  77.79,13.34 0 bottom
TP4  80.33,18.73 0 bottom
TP5  77.79,24.13 0 bottom
TP6  80.33,25.72 0 bottom
TP7  77.47,31.43 0 bottom
TP8  80.33,32.7 0 bottom
TP9  74.93,36.51 0 bottom
TP10  80.33,39.05 0 bottom
TP11  74.61,43.5 0 bottom
TP12  69.53,8.26 0 bottom
TP16  69.53,11.75 0 bottom
TP17  69.53,15.24 0 bottom
TP18  75.25,18.73 0 bottom
TP19  64.14,21.27 0 bottom
TP21  74.93,25.72 0 bottom
TP22  69.53,29.21 0 bottom
TP23  69.53,33.34 0 bottom
TP24  64.45,35.24 0 bottom
TP25  74.87,39.18 0 bottom
TP26  75.18,33.78 0 bottom
U1  33.27,24.13 0 bottom
U2  51.44,29.46 0 bottom
U3  27.3,12.7 0 bottom
U$1  51.69,18.92 0 top
U$2  140.21,14.73 270 top  (outside the outline)
U$3  -9.14,-16.64 0 top
U$4  69.81,3 90 top
U$5  80.61,3 90 top
U$6  69.22,52 270 top
U$7  80.01,52 270 top
X1  28.64,27.5 270 top
X2  88.27,10.16 90 top
X4  7.94,43.81 90 top
ZüNDSPULE  43.18,37.85 0 bottom

### Tracks (layer width: path | path; a pad name or v marks a point on that pad's centre or on a via)
+12V  (via drill 0.6)  (16 unrouted)
  Top 0.457: 42.23,39.37 v35.88,39.37
  Top 0.61: 62.23,36.83 60.01,39.37 v51.18,39.37 47.12,39.37 | 47.12,39.37 42.23,39.37 | v47.37,39.24 47.12,39.37
  Bottom 0.406: 2.86,46.99 2.86,40.96 | 2.54,39.37 R28.2
  Bottom 0.61: 2.86,40.96 2.54,39.37 | v35.88,39.37 35.24,39.37 | 2.1 | R40.2 65.34,6.83 | R41.2 74.93,10.92 72.64,8.64 69.91,8.64 TP12.TP | IC6.4 v51.18,39.37 | IC6.8 v47.37,39.24
  Bottom 0.813: 34.38,40.87 35.24,39.37 35.24,33.66 32.7,33.66 31.43,34.61 26.67,34.61 25.72,33.66 21.27,29.53 18.79,29.53 X1.6
  Bottom 1.016: R28.2 5.46,37.52 6.99,34.98
  Bottom 1.27: R28.2 X4.1 9.53,38.73 12.7,36.2 12.7,32.38 13.65,31.11 15.89,29.84 X1.6
GND  (via drill 0.6)  (49 unrouted)
  Top 0.61: X2.2 90.49,11.75 92.08,11.75 | v21.27,27.62 21.27,28.26 22.54,31.11 v22.54,32.7
  Bottom 0.61: 32.26,27.37 34.92,29.53
  Bottom 1.27: 34.92,29.53 42.86,29.53
  pour Bottom: 0,55.24 95.89,55.24 95.89,0 0,0
N$1  (3 unrouted)
  Bottom 0.61: 2.12 58.02,46.75 55.88,48.9 43.18,48.9 41.91,47.62 36.14,47.62 D17.+
N$2  (via drill 0.6)  (6 unrouted)
  Top 0.406: 33.97,51.12 56.52,51.12 63.18,46.04 69.22,46.04
  Top 0.61: X1.4 17.85,37.47 20.32,37.47 33.97,51.12 | 69.22,46.04 76.52,40.96 78.74,40.96 v80.96,41.91 81.03,41.85
  Bottom 0.406: v80.96,41.91 84.45,41.91 85.72,41.27 IC3.10
  Bottom 0.61: R31.1 X4.2 10.16,41.27 13.97,38.1 17.09,38.1 X1.4
N$3  (via drill 0.6)  (4 unrouted)
  Top 0.406: 32.07,52.39 56.2,52.39 63.18,47.31 68.9,47.31 | 70.48,48.26 73.98,48.26 75.25,47.62 76.2,45.09 79.38,45.09 80.87,44.71 81.92,44.45 83.5,44.45 v83.82,44.77
  Top 0.61: X1.3 18.02,41.59 21.27,41.59 32.07,52.39 | 68.9,47.31 70.48,48.26
  Bottom 0.406: IC3.13 84.77,45.09 84.14,44.77 v83.82,44.77
  Bottom 0.61: R30.1 X4.3 10.79,43.81 13.65,41.59 17.55,41.59 X1.3
N$4  (1 unrouted)
  Top 0.406: 35.88,23.5 41.91,23.5
  Top 0.61: X1.8 33.94,21.43 35.88,23.5 | 41.91,23.5 46.04,21.97 61.28,21.97 66.67,34.92 66.67,36.15
  Bottom 0.61: TP22.TP 66.81,29.21 2.7
N$5
  Bottom 0.406: 6.73,28.45 6.35,28.45 6.35,20.07
N$6  (via drill 0.6)  (2 unrouted)
  Top 0.61: v87,38.1 87.31,40.96 87.31,46.67 v88.42,50.37
  Bottom 0.406: IC3.3 91.12,46.35 89.53,48.9 89.22,49.73
  Bottom 0.61: v88.42,50.37 89.22,49.73
N$7  (via drill 0.6, 0.81)  (1 unrouted)
  Top 0.61: v90.81,49.53 90.81,39.37 91.44,38.1 91.44,36.2 89.85,31.43 89.85,24.45 91.44,23.18 92.71,23.18 93.34,22.23 v93.34,20.64
  Bottom 0.406: IC3.2 91.76,47.62 v90.81,49.53
N$8
  Bottom 1.27: R27.2 R28.1
N$9  (7 unrouted)
  Top 0.457: 42.55,31.43 36.51,31.43
  Top 0.61: 46.61,34.29 42.55,31.43 | 34.61,33.34 36.51,31.43
  Top 0.813: 33.34,34.92 34.61,33.34
N$10  (1 unrouted)
N$11  (via drill 0.6)  (2 unrouted)
  Top 1.016: v10.16,22.23 10.16,30.48 12.7,33.02 17.36,33.02 X1.5
  Bottom 0.406: D9.K 10.3,22.46 8.89,23.88 8.89,28.5 Q1.1
  Bottom 1.016: D9.K 10.3,22.08 v10.16,22.23
N$12  (1 unrouted)
  Top 0.711: 26.67,7.7 42.04,7.7
  Top 0.813: X1.12 21.59,5.71 26.67,7.7 | 42.04,7.7 47.82,11.88 2.2
  Bottom 0.61: TP16.TP 2.2
N$13  (1 unrouted)
  Top 0.711: 42.49,11.67 30.11,11.67
  Top 0.813: 2.3 66.75,15.24 48.45,15.24 42.49,11.67 | 30.11,11.67 21.43,9.68 X1.11
  Bottom 0.61: TP17.TP 2.3
  Bottom 0.813: 13,10.63 X1.11
N$14  (2 unrouted)
  Top 0.711: 36.51,15.61 43.81,15.61
  Top 0.813: X1.10 17.8,13.65 35.24,13.65 36.51,15.61 | 43.81,15.61 48.01,17.46 68.9,17.46 72.09,25.73
  Bottom 0.61: TP18.TP 72.28,18.73 2.4
  Bottom 0.813: 13.02,13.97 14.91,13.64 X1.10
N$15  (via drill 0.6)  (5 unrouted)
  Top 0.406: 17.91,25.4 X1.7
  Top 0.813: 26.48,36.2 27.3,32.38 24.77,30.8 23.5,28.89 23.18,26.99 21.91,25.4 17.91,25.4
  Bottom 0.457: 44.45,31.43 v32.07,31.43
  Bottom 0.61: 44.45,31.75 44.45,31.43 48.11,28.57
N$16  (1 unrouted)
N$17  (via drill 0.6)  (1 unrouted)
  Top 0.406: 29.21,53.66 56.2,53.66 62.87,48.58 67.94,48.58 | v79.06,46.67 75.56,49.21 68.9,49.21
  Top 0.61: X1.2 17.87,45.4 20.95,45.4 29.21,53.66 | 67.94,48.58 68.9,49.21
  Bottom 0.406: IC3.12 84.77,43.81 84.14,43.5 82.55,43.5 79.69,45.09 v79.06,46.67
  Bottom 0.61: R29.1 X4.4 10.79,46.35 13.97,45.4 17.7,45.4 X1.2
N$18  (1 unrouted)
  Bottom 0.406: 80.16,22.25 1.5
  Bottom 0.61: 1.5 77.56,23.9 TP5.TP
N$19  (1 unrouted)
N$20  (via drill 0.81)  (1 unrouted)
  Top 0.813: 39.79,25.18 53.98,28.57 v58.42,36.83
  Bottom 0.61: 58.42,39.23 D1.A
  Bottom 0.813: v58.42,36.83 58.42,39.23
  Bottom 1.016: 1.9 75.19,36.25 TP9.TP 70.94,36.69 69.22,38.1 64.77,38.1 63.5,36.83 v58.42,36.83
N$21  (14 unrouted)
  Top 0.813: X1.17 49.17,33.44 D2.A
  Bottom 1.016: D2.A 58.12,43.52 60.64,45.09 68.9,45.09 70.17,43.5 TP11.TP 74.93,43.18 76.8,43.18 1.11
N$22
  Bottom 1.016: 1.10 TP10.TP 77.98,39.12 76.59,40.51 74.61,41.59 69.85,41.59 69.53,41.27 63.16,41.27
  Bottom 1.422: D1.K 63.16,41.27 D2.K
N$23
  Bottom 0.406: R1.2 33.66,5.71 35.56,7.87 35.56,10.79 | 37.78,13.02 38.86,13.02 X1.22
  Bottom 0.61: 35.56,10.79 37.78,13.02
N$24  (2 unrouted)
  Bottom 0.406: 26.8,5.66 C1.1 28.57,5.71 | 28.57,5.71 28.89,5.71 | 28.89,5.71 28.26,5.4 28.57,5.71 | 28.89,5.71 R1.1
N$25  (1 unrouted)
  Bottom 0.406: 27.62,11.75 27.31,12.06 R2.2
N$26  (1 unrouted)
  Top 0.61: 66.67,28.89 69.53,20.64 68.58,19.43 48.26,19.43 42.86,17.46 39.62,17.46 X1.21
  Bottom 0.406: 37.4,17.78 X1.21
N$27  (1 unrouted)
  Bottom 0.406: 84.28,25.75 1.6
  Bottom 0.61: TP6.TP 83.03,25.72 1.6
N$28  (2 unrouted)
  Bottom 0.406: R4.1 22.16,24 | R3.1 22.16,24.13 22.16,24 | 22.01,24.15 22.16,24
N$29  (3 unrouted)
N$30  (4 unrouted)
  Bottom 0.406: U2.5 49.53,30.61 50.8,29.34 51.69,29.34 52.07,28.96 U2.2
N$31  (1 unrouted)
N$32  (1 unrouted)
N$33
  Bottom 0.61: 88.14,8.89 88.9,8.89 89.66,8.13
N$34  (1 unrouted)
N$35  (2 unrouted)
N$36  (1 unrouted)
  Bottom 0.406: IC6.7 48.64,34.54 49.02,34.16 48.26,33.4 48.26,25.53 50.42,23.37 50.42,22.48
N$37  (via drill 0.6, 0.81)  (1 unrouted)
  Top 0.61: v90.49,14.29 88.9,14.29 87.31,15.56 87.31,33.66 v88.9,38.73
  Bottom 0.406: v88.9,38.73 88.9,45.72 88.27,46.35 IC3.14
N$38
  Bottom 0.406: U2.7 52.07,30.73 52.7,30.1 54.23,30.1
N$39  (via drill 0.6, 0.81)  (1 unrouted)
  Top 0.61: v91.44,21.59 90.17,21.59 88.58,23.18 88.58,32.38 v90.17,37.47
  Bottom 0.406: v90.17,37.47 90.17,45.72 88.9,47.62 IC3.15
N$40
  Bottom 0.406: U2.3 50.8,26.16 52.96,24 U$1.6
N$41  (1 unrouted)
N$42  (1 unrouted)
  Bottom 0.61: R42.2 42.73,35.5 41.4,36.83 40.05,36.83 X1.16
N$43  (2 unrouted)
N$44  (2 unrouted)
N$45  (4 unrouted)
N$46  (1 unrouted)
  Bottom 0.406: U2.1 54.32,26.76
N$47  (1 unrouted)
N$50  (via drill 0.6, 0.81)  (1 unrouted)
  Top 0.61: v92.39,27.94 91.12,28.89 91.12,31.11 92.71,35.24 v92.71,50.8
  Bottom 0.61: v92.71,50.8 92.71,48.9 IC3.1
N$51  (1 unrouted)
  Bottom 0.406: 80.78,29.25 1.7
  Bottom 0.61: TP7.TP 77.47,29.34 1.7
N$52  (1 unrouted)
  Bottom 0.406: 1.8 83.11,32.7 85.09,32.7 85.58,32.55
  Bottom 0.61: TP8.TP 83.01,32.7 1.8
N$53  (via drill 0.6)  (1 unrouted)
  Top 0.813: 43.18,40.96 61.51,40.96 64.77,39.69 v72.2,39.69
  Bottom 0.61: TP25.TP v72.2,39.69
  Bottom 0.813: v72.2,39.69 2.10
N$54
  Bottom 1.016: D3.A 3.49,16.83
  Bottom 1.27: 3.49,16.83 2.54,13.97 R27.1
N$55  (1 unrouted)
  Top 0.406: 42.07,19.53 36.04,19.53 35.88,19.37
  Top 0.61: 72.39,33.05 61.91,20.7 46.38,20.73 42.07,19.53 | X1.9 17.92,17.46 21.59,17.46 26.35,19.37 35.88,19.37
  Bottom 0.61: TP19.TP 64.14,21.36 65.02,22.25 2.5
  Bottom 0.813: D3.K 17.79,17.14 X1.9
N$56  (1 unrouted)
N$57  (1 unrouted)
N$58
  Top 0.61: X1.24 36.45,5.72 TACHO_BELEUCHTUNG.TP
N$59  (2 unrouted)
  Bottom 0.61: T14.2 83.82,4.13 | 83.82,4.13 86.68,4.13 | 83.69,11.55 83.69,10.92 | TP2.TP 83.82,4.13
N$60  (3 unrouted)
  Bottom 0.406: 2.6 68.76,25.75
  Bottom 0.61: TP21.TP 72.3,25.72 2.6
N$61  (4 unrouted)
N$63  (via drill 0.81)  (1 unrouted)
  Bottom 0.406: 93.34,31.11 93.66,31.75 93.66,36.2 91.44,38.42 91.44,42.55 IC3.6
  Bottom 0.61: v92.71,30.48 93.34,31.11
N$64  (1 unrouted)
N$65  (1 unrouted)
N$66  (1 unrouted)
  Bottom 0.406: 84.92,18.75 1.4
  Bottom 0.61: TP4.TP 83.04,18.73 1.4
N$67  (1 unrouted)
  Bottom 0.406: 80.17,15.25 1.3
  Bottom 0.61: TP3.TP 77.79,15.02 1.3
N$68  (1 unrouted)
  Top 0.61: X2.1 92.08,8.89 R39.2
  Bottom 0.61: T13.1 70.26,1.5 | R39.2 92.08,8.89 91.44,8.26 89.53,8.26 89.53,1.33 80.64,1.27 80.42,1.5 T14.1 80.49,1.27 76.2,1.27 | 76.2,4.13 T13.2 T13.1 | 76.2,1.27 70.16,1.27 T13.1 | 76.2,1.27 76.2,3.17
N$69  (1 unrouted)
  Bottom 0.61: TP1.TP 1.1
N$70
  Bottom 0.61: 35.05,47.24 35.05,45.97 34.54,45.47
N$75
  Bottom 0.61: T13.3 68.92,6.44 68.07,5.59 R40.1
N$83
  Bottom 0.61: T14.3 81.04,9.32 R41.1
N$84  (1 unrouted)
N$85  (3 unrouted)
  Bottom 0.406: R44.2 54.61,40.07 54.61,35.56 53.98,35.56 52.7,34.29 51.82,34.29 50.8,33.27 U2.6
  Bottom 0.61: IC6.3 49.91,43.18 52.96,43.18 R44.2 52.96,43.05
N$86
  Bottom 0.61: R44.1 52.07,36.01 IC6.5
N$87  (1 unrouted)
N$88  (1 unrouted)
N$89  (2 unrouted)
N$90  (1 unrouted)
  Bottom 0.61: IC6.6 49.91,38.1 48.64,38.99 IC6.2 48.64,43.81 50.06,44.98 C6.1 50,46.42 R43.1 47.31,46.35 45.97,46.35 44.34,44.85
N$91  (1 unrouted)
N$92  (via drill 0.6)  (2 unrouted)
  Top 0.61: v72.39,34.92 73.03,35.56
  Top 0.813: X1.14 43.58,45.32 46.35,42.55 66.06,42.55 2.11
  Bottom 0.61: TP26.TP 73.34,34.92 v72.39,34.92 | D17.- 39.17,45.01 X1.14
N$93  (1 unrouted)
  Bottom 1.016: 64.77,35.24 65.9,35.42 65.94,35.42 2.9
N$94
  Bottom 1.016: 2.8 TP23.TP 69.39,33.19 69.05,33.19
N$96  (2 unrouted)
N$97  (1 unrouted)
N$98  (1 unrouted)
N$99  (1 unrouted)
N$100  (3 unrouted)
N$102  (2 unrouted)
N$104  (1 unrouted)
N$105  (1 unrouted)
N$106  (2 unrouted)
VCC  (12 unrouted)
  Bottom 0.406: 48.01,22.73 42.86,19.05 41.91,19.53 35.24,19.53 33.97,20.64 31.43,20.64 29.21,17.46

### Text on the board
Top: top | Brotbox V2.1 / www.flyingbrick.de
tPlace: G5 | G4 | G3 | G2 | QC | G1
tNames: GND c b a 12V(rt) | GND / c / b / a | 12V rt | 18 | 19 | 2.7 / 2.6 | 8 | 1.12 / 1.11 / 1.1 / 1.9 / 1.8 / 1.7 / 1.6 / 1.5 / 1.4 / 1.3 | 1.2 | 1.1 | 1 / 2 / 3 / 4 / 5 / 6 / 7 / / 9 / 10 / 11 / 12 | 2.12 / 2.11 / 2.1 / 2.9 / 2.8 / / / 2.5 / 2.4 / 2.3 / 2.2 / 2.1 | 13 / 14 / 15 / 16 / 17 / / / 20 / 21 / 22 / 23 / 24
bNames: 3x | LM2904
tStop: Brotbox V2.0 / www.flyingbrick.de
tDocu: +12v